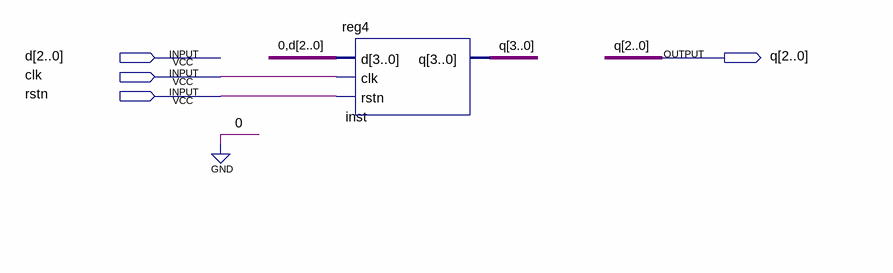
[diagram p0: schematic sheet]
// Quartus schematic reg3.bdf as structural Verilog: 1 symbols, 4 pins
module reg3 (
  input  [2:0] d,
  input  clk,
  input  rstn,
  output [3:0] q
);

  reg4 inst (.d({1'b0, d}), .clk(clk), .rstn(rstn), .q(q));
endmodule
